# EAGLE schematic jupiter6-filter (EAGLE 7.2.0)
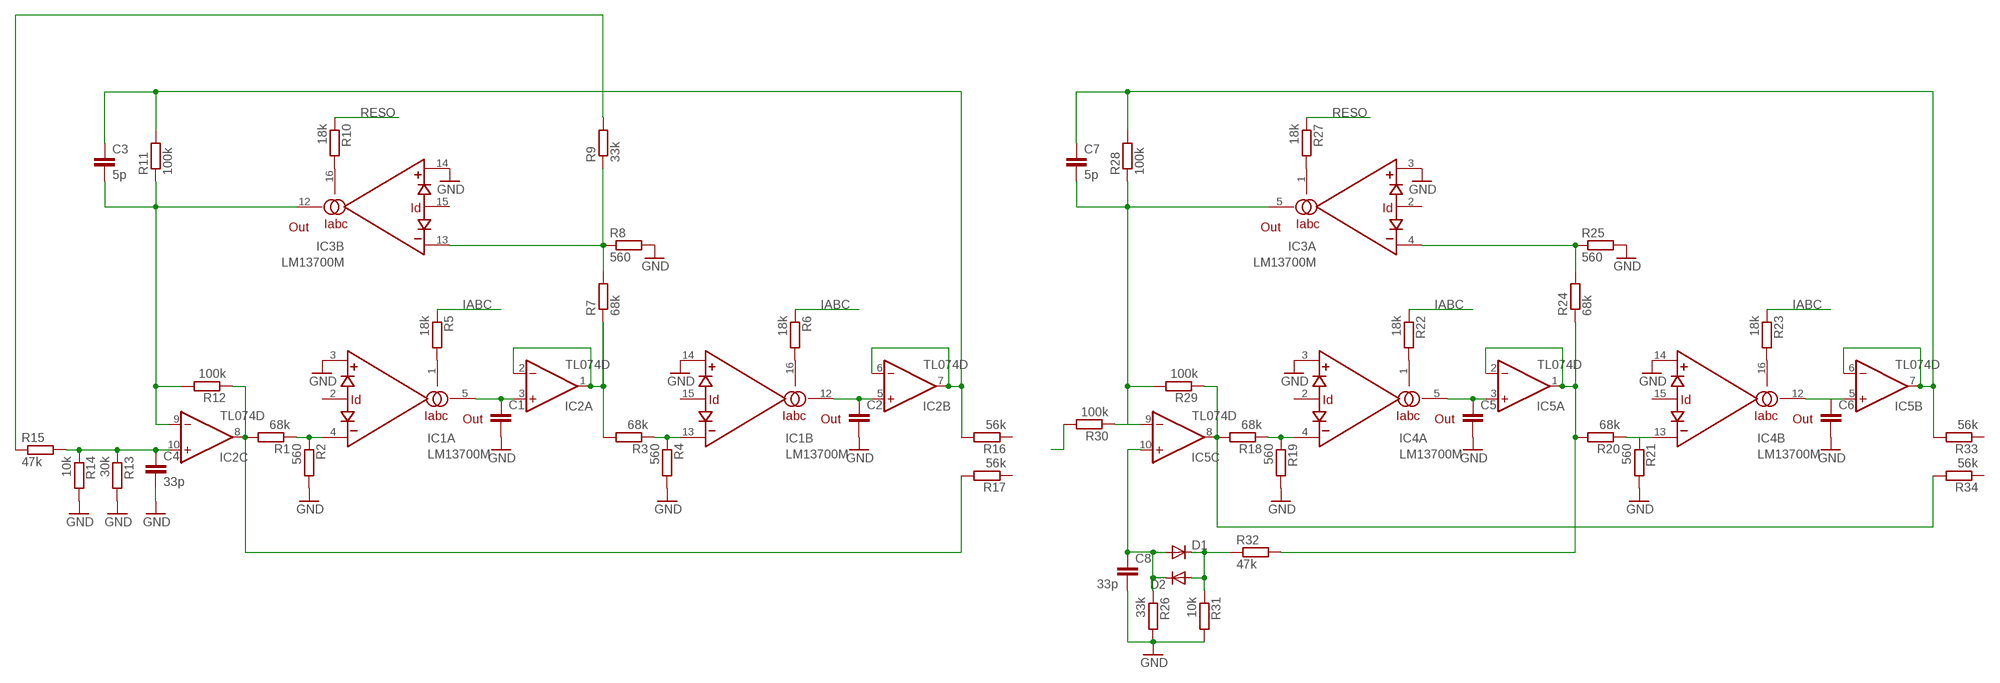
[diagram p0: schematic, sheet 1]

## Parts
C1  C-EUC0603  [C0603]
C2  C-EUC0603  [C0603]
C3  5p  C-EUC0603  [C0603]
C4  33p  C-EUC0603  [C0603]
C5  C-EUC0603  [C0603]
C6  C-EUC0603  [C0603]
C7  5p  C-EUC0603  [C0603]
C8  33p  C-EUC0603  [C0603]
D1  DIODE-SOD80C  [SOD80C]
D2  DIODE-SOD80C  [SOD80C]
IC1  LM13700M  [SO16]
IC2  TL074D  [SO14]
IC3  LM13700M  [SO16]
IC4  LM13700M  [SO16]
IC5  TL074D  [SO14]
R1  68k  R-EU_R0603  [R0603]
R2  560  R-EU_R0603  [R0603]
R3  68k  R-EU_R0603  [R0603]
R4  560  R-EU_R0603  [R0603]
R5  18k  R-EU_R0603  [R0603]
R6  18k  R-EU_R0603  [R0603]
R7  68k  R-EU_R0603  [R0603]
R8  560  R-EU_R0603  [R0603]
R9  33k  R-EU_R0603  [R0603]
R10  18k  R-EU_R0603  [R0603]
R11  100k  R-EU_R0603  [R0603]
R12  100k  R-EU_R0603  [R0603]
R13  30k  R-EU_R0603  [R0603]
R14  10k  R-EU_R0603  [R0603]
R15  47k  R-EU_R0603  [R0603]
R16  56k  R-EU_R0603  [R0603]
R17  56k  R-EU_R0603  [R0603]
R18  68k  R-EU_R0603  [R0603]
R19  560  R-EU_R0603  [R0603]
R20  68k  R-EU_R0603  [R0603]
R21  560  R-EU_R0603  [R0603]
R22  18k  R-EU_R0603  [R0603]
R23  18k  R-EU_R0603  [R0603]
R24  68k  R-EU_R0603  [R0603]
R25  560  R-EU_R0603  [R0603]
R26  33k  R-EU_R0603  [R0603]
R27  18k  R-EU_R0603  [R0603]
R28  100k  R-EU_R0603  [R0603]
R29  100k  R-EU_R0603  [R0603]
R30  100k  R-EU_R0603  [R0603]
R31  10k  R-EU_R0603  [R0603]
R32  47k  R-EU_R0603  [R0603]
R33  56k  R-EU_R0603  [R0603]
R34  56k  R-EU_R0603  [R0603]

## Nets
GND: C1.2 C2.2 C4.2 C5.2 C6.2 C8.2 IC1.3(A:+IN) IC1.14(B:+IN) IC3.3(A:+IN) IC3.14(B:+IN) IC4.3(A:+IN) IC4.14(B:+IN) R2.2 R4.2 R8.2 R13.2 R14.2 R19.2 R21.2 R25.2 R26.2 R31.2
IABC: R5.1 R6.1 R22.1 R23.1
N$1: C2.1 IC1.12(B:OUT) IC2.5(B:+IN)
N$2: IC1.4(A:-IN) R1.1 R2.1
N$3: IC2.1(A:OUT) IC2.2(A:-IN) R3.2 R7.1
N$4: C3.1 IC2.6(B:-IN) IC2.7(B:OUT) R11.2 R16.2
N$5: C1.1 IC1.5(A:OUT) IC2.3(A:+IN)
N$6: IC1.1(A:IABC) R5.2
N$7: IC1.16(B:IABC) R6.2
N$8: IC1.13(B:-IN) R3.1 R4.1
N$9: IC3.13(B:-IN) R7.2 R8.1 R9.1
N$10: R9.2 R15.1
N$11: IC3.16(B:IABC) R10.2
N$12: IC5.1(A:OUT) IC5.2(A:-IN) R20.2 R24.1 R32.2
N$13: IC2.8(C:OUT) R1.2 R12.1 R17.2
N$14: C3.2 IC2.9(C:-IN) IC3.12(B:OUT) R11.1 R12.2
N$15: C7.1 IC5.6(B:-IN) IC5.7(B:OUT) R28.2 R33.2
N$16: C4.1 IC2.10(C:+IN) R13.1 R14.1 R15.2
N$17: C5.1 IC4.5(A:OUT) IC5.3(A:+IN)
N$18: C6.1 IC4.12(B:OUT) IC5.5(B:+IN)
N$19: IC4.4(A:-IN) R18.1 R19.1
N$20: IC4.1(A:IABC) R22.2
N$21: IC4.16(B:IABC) R23.2
N$22: IC4.13(B:-IN) R20.1 R21.1
N$23: IC3.4(A:-IN) R24.2 R25.1
N$24: D1.C D2.A R31.1 R32.1
N$25: IC3.1(A:IABC) R27.2
N$26: IC5.8(C:OUT) R18.2 R29.1 R34.2
N$27: C7.2 IC3.5(A:OUT) IC5.9(C:-IN) R28.1 R29.2 R30.1
N$28: R30.2
N$29: C8.1 D1.A D2.C IC5.10(C:+IN) R26.1
RESO: R10.1 R27.1
Unconnected: IC1.2(A:ID) IC1.6(V-) IC1.7(IN) IC1.8(OUT) IC1.9(OUT) IC1.10(IN) IC1.11(V+) IC1.15(B:ID) IC2.12(D:+IN) IC2.13(D:-IN) IC2.14(D:OUT) IC3.2(A:ID) IC3.6(V-) IC3.7(IN) IC3.8(OUT) IC3.9(OUT) IC3.10(IN) IC3.11(V+) IC3.15(B:ID) IC4.2(A:ID) IC4.6(V-) IC4.7(IN) IC4.8(OUT) IC4.9(OUT) IC4.10(IN) IC4.11(V+) IC4.15(B:ID) IC5.12(D:+IN) IC5.13(D:-IN) IC5.14(D:OUT) R16.1 R17.1 R33.1 R34.1

## Power pins joined to a net without a drawn wire
V+: IC2.4(P:V+) IC5.4(P:V+)
V-: IC2.11(P:V-) IC5.11(P:V-)

## Library data of the parts
C1-C8 = resistor:C-EU: CAPACITOR, European symbol
D1 D2 = diode:DIODE-: DIODE
IC1 IC3 IC4 = joakim:LM13700: National Dual OTA with buffers.
IC2 IC5 = linear:TL074: OP AMP
R1-R34 = resistor:R-EU_: RESISTOR, European symbol